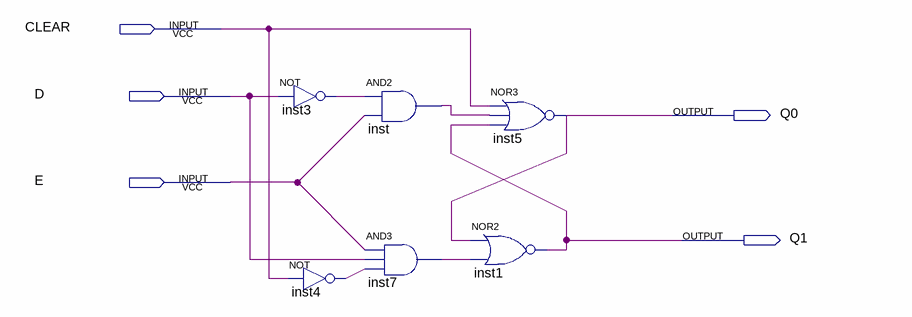
[diagram p0: schematic sheet]
// Quartus schematic latch_d.bdf as structural Verilog: 6 symbols, 5 pins
module latch_d (
  input  CLEAR,
  input  D,
  input  E,
  output Q0,
  output Q1
);

  wire inst3_out, inst4_out, inst7_out, inst_out;

  not inst3 (inst3_out, D);
  not inst4 (inst4_out, CLEAR);
  and inst (inst_out, inst3_out, E);
  and inst7 (inst7_out, E, D, inst4_out);
  nor inst5 (Q0, CLEAR, inst_out, Q1);
  nor inst1 (Q1, Q0, inst7_out);
endmodule
